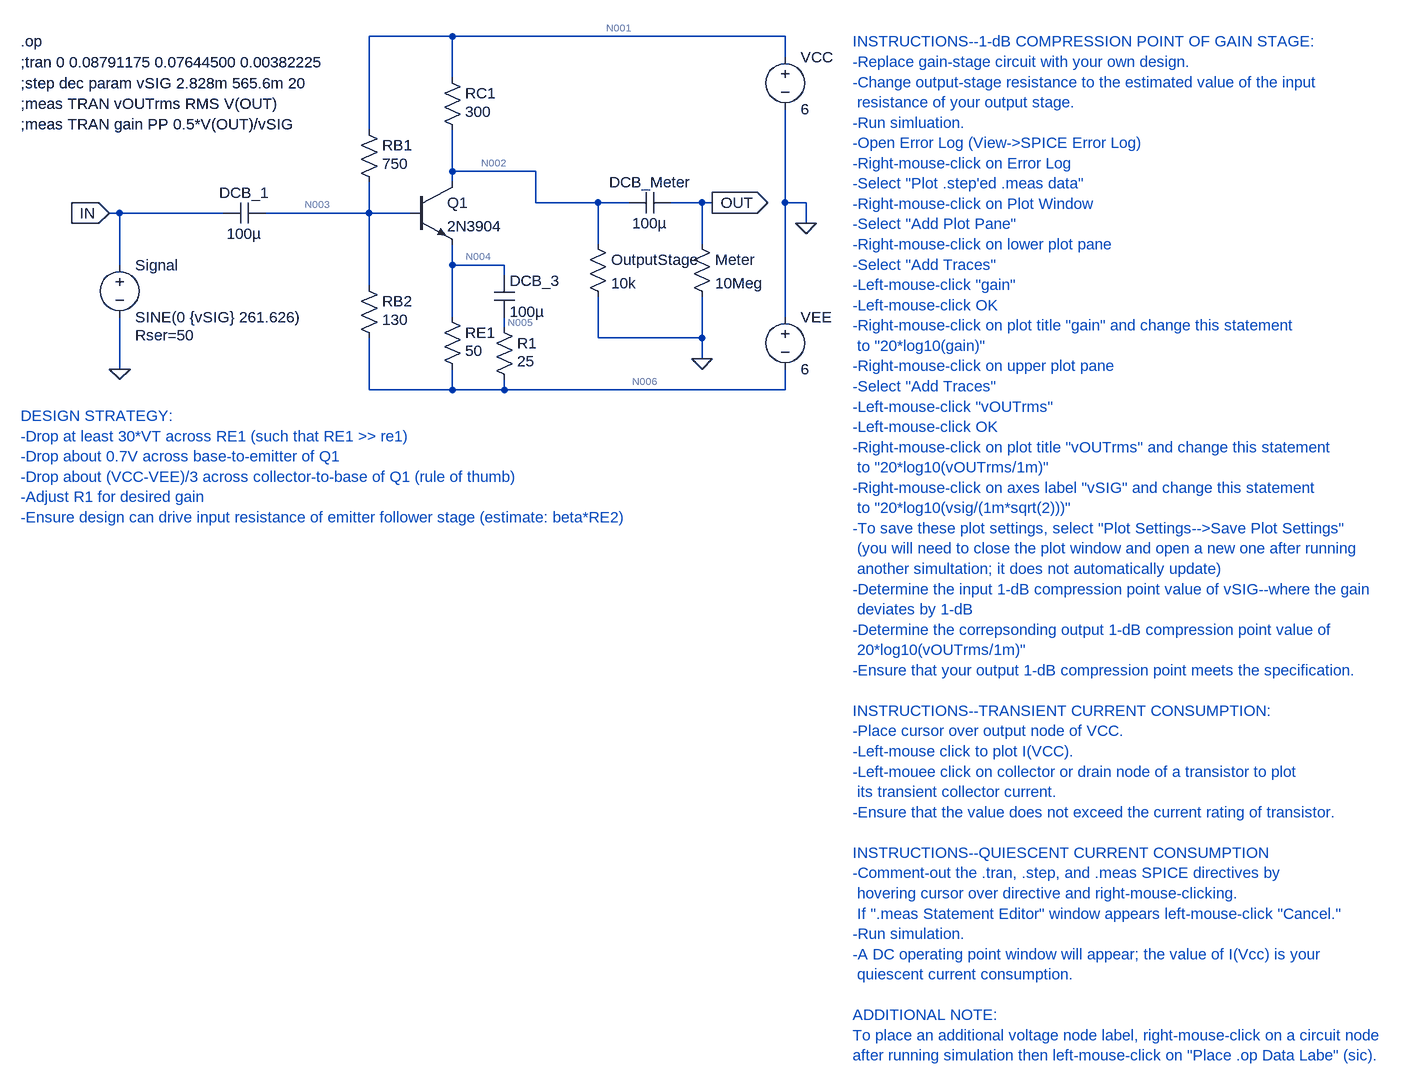
[diagram p0: schematic VoltageGainStageTest.asc]
VoltageGainStageTest.asc, the LTspice schematic file:
Version 4
SHEET 1 2440 1204
WIRE 192 -304 64 -304
WIRE 704 -304 192 -304
WIRE 704 -272 704 -304
WIRE 192 -240 192 -304
WIRE 64 -160 64 -304
WIRE 192 -96 192 -160
WIRE 320 -96 192 -96
WIRE 192 -80 192 -96
WIRE 320 -48 320 -96
WIRE 416 -48 320 -48
WIRE 464 -48 416 -48
WIRE 576 -48 528 -48
WIRE 592 -48 576 -48
WIRE 704 -48 704 -192
WIRE 736 -48 704 -48
WIRE -320 -32 -336 -32
WIRE -160 -32 -320 -32
WIRE 64 -32 64 -80
WIRE 64 -32 -96 -32
WIRE 128 -32 64 -32
WIRE 736 -16 736 -48
WIRE 416 16 416 -48
WIRE 576 16 576 -48
WIRE -320 48 -320 -32
WIRE 192 48 192 16
WIRE 272 48 192 48
WIRE 272 64 272 48
WIRE 64 80 64 -32
WIRE 192 128 192 48
WIRE 704 128 704 -48
WIRE 272 144 272 128
WIRE 416 160 416 96
WIRE 576 160 576 96
WIRE 576 160 416 160
WIRE 576 192 576 160
WIRE -320 208 -320 128
WIRE 64 240 64 160
WIRE 192 240 192 208
WIRE 192 240 64 240
WIRE 272 240 272 224
WIRE 272 240 192 240
WIRE 704 240 704 208
WIRE 704 240 272 240
FLAG -320 208 0
FLAG 592 -48 OUT
IOPIN 592 -48 Out
FLAG -336 -32 IN
IOPIN -336 -32 In
FLAG 736 -16 0
FLAG 576 192 0
DATAFLAG 272 48 "$-V(n006)"
DATAFLAG 96 -32 "$-V(n004)"
DATAFLAG 320 -96 "$-V(n003)"
DATAFLAG 704 -304 "I(Vcc)"
DATAFLAG 192 -288 "Ic(Q1)"
DATAFLAG 624 240 "I(Vee)"
SYMBOL voltage 704 -288 R0
WINDOW 123 0 0 Left 0
WINDOW 39 0 0 Left 0
SYMATTR InstName VCC
SYMATTR Value 6
SYMBOL res 48 -176 R0
WINDOW 3 36 68 Left 2
SYMATTR Value 750
SYMATTR InstName RB1
SYMBOL res 48 64 R0
WINDOW 3 36 68 Left 2
SYMATTR Value 130
SYMATTR InstName RB2
SYMBOL res 560 0 R0
SYMATTR InstName Meter
SYMATTR Value 10Meg
SYMBOL voltage -320 32 R0
WINDOW 123 0 0 Left 2
WINDOW 39 24 124 Left 2
SYMATTR SpiceLine Rser=50
SYMATTR InstName Signal
SYMATTR Value SINE(0 {vSIG} 261.626)
SYMBOL cap 528 -64 R90
WINDOW 0 0 32 VBottom 2
WINDOW 3 32 32 VTop 2
SYMATTR InstName DCB_Meter
SYMATTR Value 100µ
SYMBOL cap -96 -48 R90
WINDOW 0 0 32 VBottom 2
WINDOW 3 32 32 VTop 2
SYMATTR InstName DCB_1
SYMATTR Value 100µ
SYMBOL res 176 112 R0
WINDOW 3 36 68 Left 2
SYMATTR Value 50
SYMATTR InstName RE1
SYMBOL res 256 128 R0
WINDOW 3 36 68 Left 2
SYMATTR Value 25
SYMATTR InstName R1
SYMBOL cap 256 64 R0
SYMATTR InstName DCB_3
SYMATTR Value 100µ
SYMBOL res 176 -256 R0
WINDOW 3 36 68 Left 2
SYMATTR Value 300
SYMATTR InstName RC1
SYMBOL npn 128 -80 R0
SYMATTR InstName Q1
SYMATTR Value 2N3904
SYMBOL res 400 0 R0
SYMATTR InstName OutputStage
SYMATTR Value 10k
SYMBOL voltage 704 112 R0
WINDOW 123 0 0 Left 0
WINDOW 39 0 0 Left 0
SYMATTR InstName VEE
SYMATTR Value 6
TEXT -472 -232 Left 2 !;step dec param vSIG 2.828m 565.6m 20
TEXT -472 -264 Left 2 !;tran 0 0.08791175 0.07644500 0.00382225
TEXT -472 -200 Left 2 !;meas TRAN vOUTrms RMS V(OUT)\n;meas TRAN gain PP 0.5*V(OUT)/vSIG
TEXT -472 -296 Left 2 !.op
TEXT 808 -296 Left 2 ;INSTRUCTIONS--1-dB COMPRESSION POINT OF GAIN STAGE:\n-Replace gain-stage circuit with your own design.\n-Change output-stage resistance to the estimated value of the input \n resistance of your output stage.\n-Run simluation.\n-Open Error Log (View->SPICE Error Log)\n-Right-mouse-click on Error Log\n-Select "Plot .step'ed .meas data"\n-Right-mouse-click on Plot Window\n-Select "Add Plot Pane"\n-Right-mouse-click on lower plot pane\n-Select "Add Traces"\n-Left-mouse-click "gain"\n-Left-mouse-click OK\n-Right-mouse-click on plot title "gain" and change this statement\n to "20*log10(gain)"\n-Right-mouse-click on upper plot pane\n-Select "Add Traces"\n-Left-mouse-click "vOUTrms"\n-Left-mouse-click OK\n-Right-mouse-click on plot title "vOUTrms" and change this statement\n to "20*log10(vOUTrms/1m)"\n-Right-mouse-click on axes label "vSIG" and change this statement\n to "20*log10(vsig/(1m*sqrt(2)))"\n-To save these plot settings, select "Plot Settings-->Save Plot Settings"\n (you will need to close the plot window and open a new one after running \n another simultation; it does not automatically update)\n-Determine the input 1-dB compression point value of vSIG--where the gain\n deviates by 1-dB\n-Determine the correpsonding output 1-dB compression point value of \n 20*log10(vOUTrms/1m)"\n-Ensure that your output 1-dB compression point meets the specification.\n \nINSTRUCTIONS--TRANSIENT CURRENT CONSUMPTION:\n-Place cursor over output node of VCC.\n-Left-mouse click to plot I(VCC).\n-Left-mouee click on collector or drain node of a transistor to plot \n its transient collector current.\n-Ensure that the value does not exceed the current rating of transistor.\n \nINSTRUCTIONS--QUIESCENT CURRENT CONSUMPTION\n-Comment-out the .tran, .step, and .meas SPICE directives by \n hovering cursor over directive and right-mouse-clicking.\n If ".meas Statement Editor" window appears left-mouse-click "Cancel."\n-Run simulation.\n-A DC operating point window will appear; the value of I(Vcc) is your \n quiescent current consumption.\n \nADDITIONAL NOTE:\nTo place an additional voltage node label, right-mouse-click on a circuit node\nafter running simulation then left-mouse-click on "Place .op Data Labe" (sic).
TEXT -472 280 Left 2 ;DESIGN STRATEGY:\n-Drop at least 30*VT across RE1 (such that RE1 >> re1)\n-Drop about 0.7V across base-to-emitter of Q1\n-Drop about (VCC-VEE)/3 across collector-to-base of Q1 (rule of thumb)\n-Adjust R1 for desired gain\n-Ensure design can drive input resistance of emitter follower stage (estimate: beta*RE2)

The netlist it stands for:
* VoltageGainStageTest.asc
VCC N001 0 6
RB1 N001 N003 750
RB2 N003 N006 130
R§Meter OUT 0 10Meg
V§Signal IN 0 SINE(0 {vSIG} 261.626) Rser=50
C§DCB_Meter OUT N002 100µ
C§DCB_1 N003 IN 100µ
RE1 N004 N006 50
R1 N005 N006 25
C§DCB_3 N004 N005 100µ
RC1 N001 N002 300
Q1 N002 N003 N004 0 2N3904
R§OutputStage N002 0 10k
VEE 0 N006 6
.model NPN NPN
.model PNP PNP
.lib standard.bjt
;step dec param vSIG 2.828m 565.6m 20
;tran 0 0.08791175 0.07644500 0.00382225
;meas TRAN vOUTrms RMS V(OUT)
;meas TRAN gain PP 0.5*V(OUT)/vSIG
.op
* INSTRUCTIONS--1-dB COMPRESSION POINT OF GAIN STAGE:
* -Replace gain-stage circuit with your own design.
* -Change output-stage resistance to the estimated value of the input
*  resistance of your output stage.
* -Run simluation.
* -Open Error Log (View->SPICE Error Log)
* -Right-mouse-click on Error Log
* -Select "Plot .step'ed .meas data"
* -Right-mouse-click on Plot Window
* -Select "Add Plot Pane"
* -Right-mouse-click on lower plot pane
* -Select "Add Traces"
* -Left-mouse-click "gain"
* -Left-mouse-click OK
* -Right-mouse-click on plot title "gain" and change this statement
*  to "20*log10(gain)"
* -Right-mouse-click on upper plot pane
* -Select "Add Traces"
* -Left-mouse-click "vOUTrms"
* -Left-mouse-click OK
* -Right-mouse-click on plot title "vOUTrms" and change this statement
*  to "20*log10(vOUTrms/1m)"
* -Right-mouse-click on axes label "vSIG" and change this statement
*  to "20*log10(vsig/(1m*sqrt(2)))"
* -To save these plot settings, select "Plot Settings-->Save Plot Settings"
*  (you will need to close the plot window and open a new one after running
*  another simultation; it does not automatically update)
* -Determine the input 1-dB compression point value of vSIG--where the gain
*  deviates by 1-dB
* -Determine the correpsonding output 1-dB compression point value of
*  20*log10(vOUTrms/1m)"
* -Ensure that your output 1-dB compression point meets the specification.
* INSTRUCTIONS--TRANSIENT CURRENT CONSUMPTION:
* -Place cursor over output node of VCC.
* -Left-mouse click to plot I(VCC).
* -Left-mouee click on collector or drain node of a transistor to plot
*  its transient collector current.
* -Ensure that the value does not exceed the current rating of transistor.
* INSTRUCTIONS--QUIESCENT CURRENT CONSUMPTION
* -Comment-out the .tran, .step, and .meas SPICE directives by
*  hovering cursor over directive and right-mouse-clicking.
*  If ".meas Statement Editor" window appears left-mouse-click "Cancel."
* -Run simulation.
* -A DC operating point window will appear; the value of I(Vcc) is your
*  quiescent current consumption.
* ADDITIONAL NOTE:
* To place an additional voltage node label, right-mouse-click on a circuit node
* after running simulation then left-mouse-click on "Place .op Data Labe" (sic).
* DESIGN STRATEGY:
* -Drop at least 30*VT across RE1 (such that RE1 >> re1)
* -Drop about 0.7V across base-to-emitter of Q1
* -Drop about (VCC-VEE)/3 across collector-to-base of Q1 (rule of thumb)
* -Adjust R1 for desired gain
* -Ensure design can drive input resistance of emitter follower stage (estimate: beta*RE2)
.backanno
.end

* Results of the author's LTspice run, read from the files saved beside the schematic
* Operating Point (first step), zero values left out:
*   vsig = 2.828 m
*   V(n001) = 6 V
*   V(n003) = -4.235 V
*   V(n006) = -6 V
*   V(n002) = -144.3 mV
*   V(n004) = -4.972 V
*   V(n005) = -6 V
*   Ic(Q1) = 20.5 mA
*   Ib(Q1) = 68.87 µA
*   Ie(Q1) = -20.56 mA
*   I(Outputstage) = -14.43 µA
*   I(Rc1) = 20.48 mA
*   I(Re1) = 20.56 mA
*   I(Rb2) = 13.58 mA
*   I(Rb1) = 13.65 mA
*   I(Vee) = -34.14 mA
*   I(Vcc) = -34.13 mA
* Operating Point:
*   V(n001) = 6 V
*   V(n003) = -4.235 V
*   V(n006) = -6 V
*   V(out) = -144.3 pV
*   V(in) = 0 V
*   V(n002) = -144.3 mV
*   V(n004) = -4.972 V
*   V(n005) = -6 V
*   Ic(Q1) = 20.5 mA
*   Ib(Q1) = 68.87 µA
*   Ie(Q1) = -20.56 mA
*   I(Dcb_3) = 0 A
*   I(Dcb_1) = 0 A
*   I(Dcb_meter) = 0 A
*   I(Outputstage) = -14.43 µA
*   I(Rc1) = 20.48 mA
*   I(R1) = 0 A
*   I(Re1) = 20.56 mA
*   I(Meter) = 0 A
*   I(Rb2) = 13.58 mA
*   I(Rb1) = 13.65 mA
*   I(Vee) = -34.14 mA
*   I(Signal) = 0 A
*   I(Vcc) = -34.13 mA
* From the log:
*   Semiconductor Device Operating Points:
*                           --- Bipolar Transistors ---
*   Name:       q1
*   Model:    2n3904
*   Ib:       6.89e-05
*   Ic:       2.05e-02
*   Vbe:      7.37e-01
*   Vbc:     -4.09e+00
*   Vce:      4.83e+00
*   BetaDC:   2.98e+02
*   Gm:       7.57e-01
*   Rpi:      3.76e+02
*   Rx:       2.00e+01
*   Ro:       5.08e+03
*   Cbe:      2.78e-10
*   Cbc:      2.16e-12
*   Cjs:      0.00e+00
*   BetaAC:   2.84e+02
*   Cbx:      0.00e+00
*   Ft:       4.29e+08